# EAGLE design publish1 (EAGLE 6.5.0)
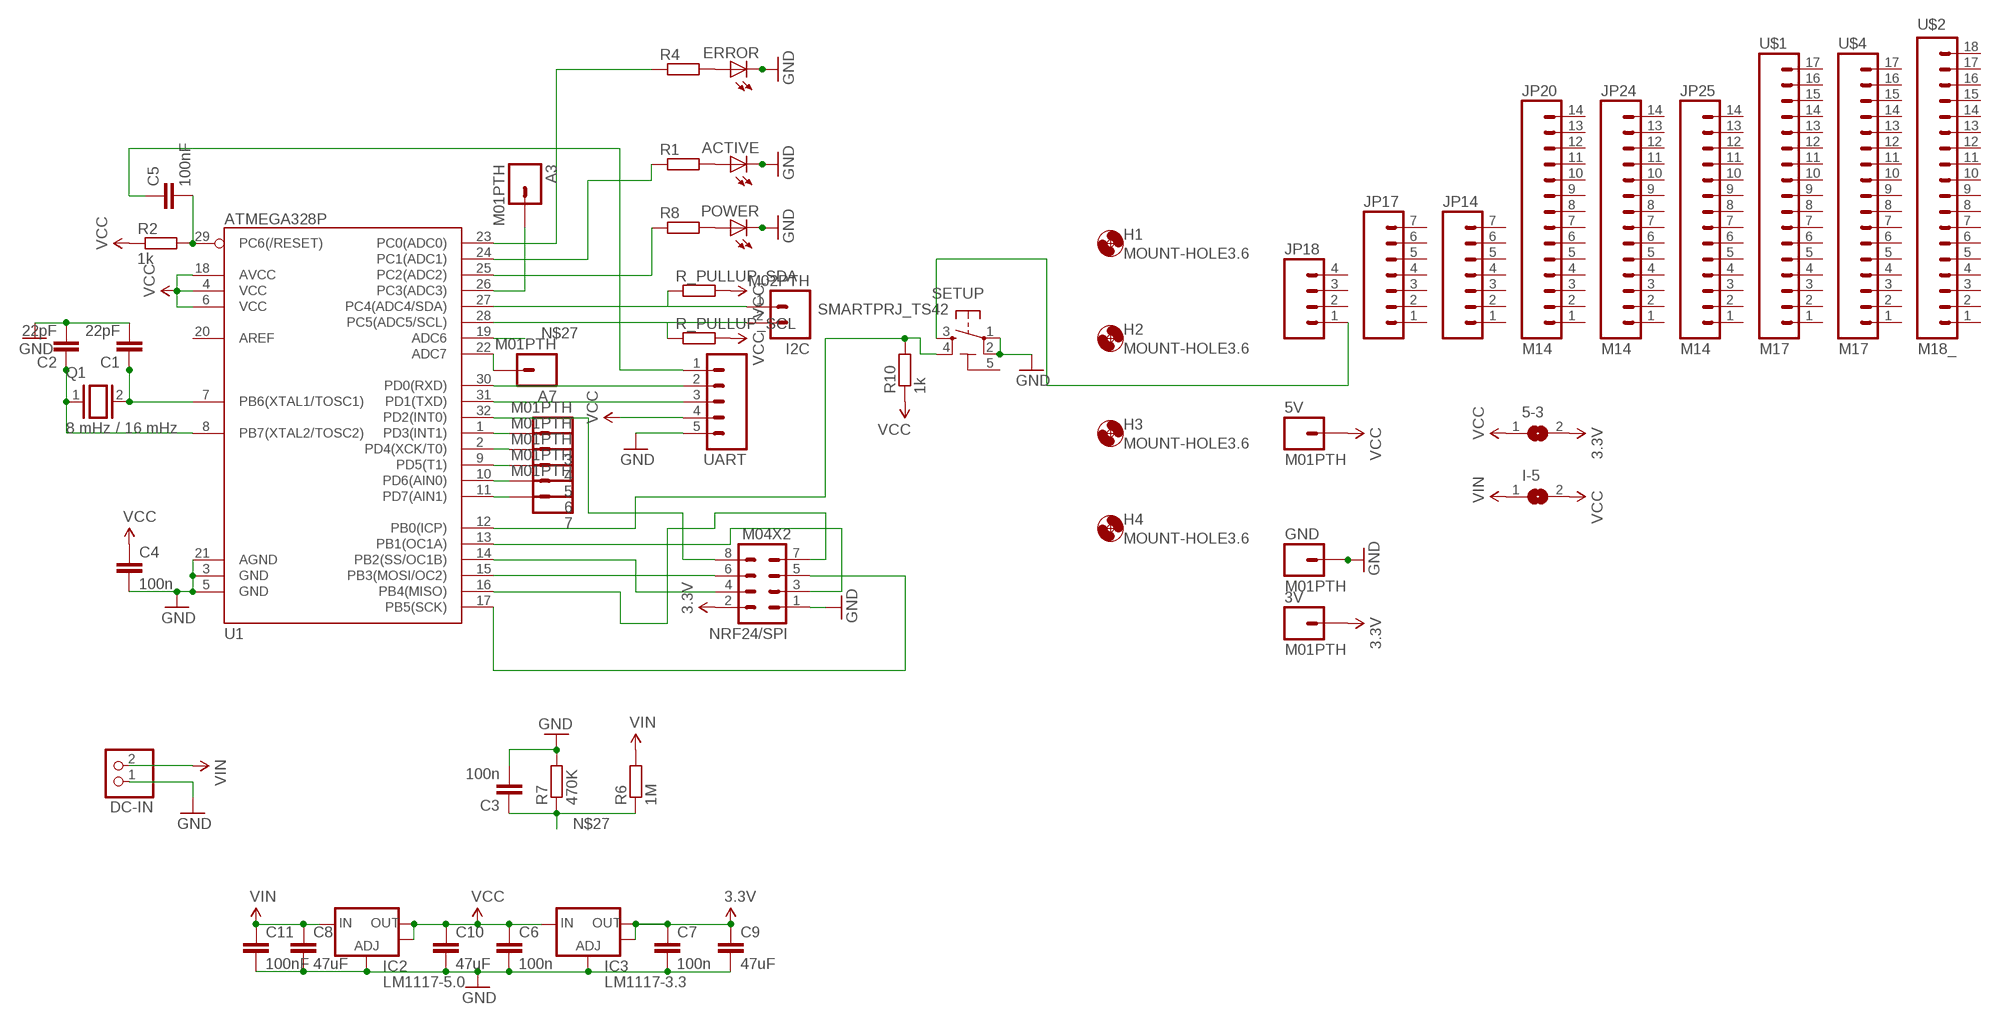
[diagram p0: schematic, sheet 1]

## Parts
3  M01PTH  [1X01]
3V  M01PTH  [1X01]
4  M01PTH  [1X01]
5  M01PTH  [1X01]
5-3  JUMPER_SJ  [JUMPER_SJ]
5V  M01PTH  [1X01]
6  M01PTH  [1X01]
7  M01PTH  [1X01]
A3  M01PTH  [1X01]
A7  M01PTH  [1X01]
ACTIVE  LEDCHIP-LED0805  [CHIP-LED0805]
C1  22pF  C-EUC0805K  [C0805K]
C2  22pF  C-EUC0805K  [C0805K]
C3  100n  C-EUC0805K  [C0805K]
C4  100n  C-EUC0805K  [C0805K]
C5  100nF  C-EUC0805K  [C0805K]
C6  100n  C-EUC0805K  [C0805K]
C7  100n  C-EUC0805K  [C0805K]
C8  47uF  22UF-16V-20%-(1210)  [1210]
C9  47uF  22UF-16V-20%-(1210)  [1210]
C10  47uF  22UF-16V-20%-(1210)  [1210]
C11  100nF  C-EUC0805K  [C0805K]
DC-IN  PINHD-1X2  [1X02]
ERROR  LEDCHIP-LED0805  [CHIP-LED0805]
GND  M01PTH  [1X01]
H1  MOUNT-HOLE3.6  [3,6]
H2  MOUNT-HOLE3.6  [3,6]
H3  MOUNT-HOLE3.6  [3,6]
H4  MOUNT-HOLE3.6  [3,6]
I2C  M02PTH  [1X02]
I-5  JUMPER_SJ  [JUMPER_SJ]
IC2  LM1117-5.0  V_REG_LM1117SOT223  [SOT223]
IC3  LM1117-3.3  V_REG_LM1117SOT223  [SOT223]
JP14  M07  [1X07]
JP17  M07  [1X07]
JP18  M04PTH  [1X04]
JP20  M14  [1X14]
JP24  M14  [1X14]
JP25  M14  [1X14]
NRF24/SPI  M04X2  [2X4]
POWER  LEDCHIP-LED0805  [CHIP-LED0805]
Q1  8 mHz / 16 mHz  XTAL/S  [QS]
R1  SMARTPRJ_R-EU_M0805  [SMARTPRJ_M0805]
R2  1k  SMARTPRJ_R-EU_M0805  [SMARTPRJ_M0805]
R4  SMARTPRJ_R-EU_M0805  [SMARTPRJ_M0805]
R6  1M  SMARTPRJ_R-EU_M0805  [SMARTPRJ_M0805]
R7  470K  SMARTPRJ_R-EU_M0805  [SMARTPRJ_M0805]
R8  SMARTPRJ_R-EU_M0805  [SMARTPRJ_M0805]
R10  1k  SMARTPRJ_R-EU_M0805  [SMARTPRJ_M0805]
R_PULLUP_SCL  SMARTPRJ_R-EU_M0805  [SMARTPRJ_M0805]
R_PULLUP_SDA  SMARTPRJ_R-EU_M0805  [SMARTPRJ_M0805]
SETUP  SMARTPRJ_TS42  [SMARTPRJ_TS42]
U1  ATMEGA328P  ATMEGA328_SMT  [TQFP32-08]
U$1  M17  [1X17]
U$2  M18_  [1X18]
U$4  M17  [1X17]
UART  M05PTH  [1X05]

## Nets
3.3V: 3V.1 5-3.2 C7.1 C9.1 IC3.2(OUT) IC3.4(OUT) NRF24/SPI.2
GND: ACTIVE.C C1.2 C2.2 C3.2 C4.2 C6.2 C7.2 C8.2 C9.2 C10.2 C11.2 DC-IN.1 ERROR.C GND.1 IC2.1(ADJ) IC3.1(ADJ) NRF24/SPI.1 POWER.C R7.2 SETUP.1 SETUP.2 U1.3(GND) U1.5(GND) U1.21(AGND) UART.5
N$1: C1.1 Q1.2 U1.7(PB6(XTAL1/TOSC1))
N$2: C2.1 Q1.1 U1.8(PB7(XTAL2/TOSC2))
N$3: NRF24/SPI.3 U1.13(PB1(OC1A))
N$4: NRF24/SPI.4 U1.14(PB2(SS/OC1B))
N$5: NRF24/SPI.5 U1.17(PB5(SCK))
N$6: NRF24/SPI.7 U1.16(PB4(MISO))
N$7: C5.1 UART.1
N$8: U1.30(PD0(RXD)) UART.2
N$9: U1.31(PD1(TXD)) UART.3
N$10: NRF24/SPI.6 U1.15(PB3(MOSI/OC2))
N$11: C5.2 R2.2 U1.29(PC6(/RESET))
N$12: NRF24/SPI.8 U1.32(PD2(INT0))
N$13: ACTIVE.A R1.2
N$14: ERROR.A R4.2
N$16: JP18.1 SETUP.3
N$20: R4.1 U1.23(PC0(ADC0))
N$21: R1.1 U1.24(PC1(ADC1))
N$27: C3.1 R6.1 R7.1 U1.19(ADC6)
N$41: POWER.A R8.2
N$42: R8.1 U1.25(PC2(ADC2))
N$44: A3.1 U1.26(PC3(ADC3))
N$45: 3.1 U1.1(PD3(INT1))
N$46: 4.1 U1.2(PD4(XCK/T0))
N$47: 5.1 U1.9(PD5(T1))
N$48: 6.1 U1.10(PD6(AIN0))
N$49: 7.1 U1.11(PD7(AIN1))
N$50: A7.1 U1.22(ADC7)
N$51: R10.2 SETUP.4 U1.12(PB0(ICP))
SCL: I2C.2 R_PULLUP_SCL.1 U1.28(PC5(ADC5/SCL))
SDA: I2C.1 R_PULLUP_SDA.1 U1.27(PC4(ADC4/SDA))
VCC: 5-3.1 5V.1 C4.1 C6.1 C10.1 I-5.2 IC2.2(OUT) IC2.4(OUT) IC3.3(IN) R2.1 R10.1 R_PULLUP_SCL.2 R_PULLUP_SDA.2 U1.4(VCC) U1.6(VCC) U1.18(AVCC) UART.4
VIN: C8.1 C11.1 DC-IN.2 I-5.1 IC2.3(IN) R6.2
Unconnected: JP14.1 JP14.2 JP14.3 JP14.4 JP14.5 JP14.6 JP14.7 JP17.1 JP17.2 JP17.3 JP17.4 JP17.5 JP17.6 JP17.7 JP18.2 JP18.3 JP18.4 JP20.1 JP20.2 JP20.3 JP20.4 JP20.5 JP20.6 JP20.7 JP20.8 JP20.9 JP20.10 JP20.11 JP20.12 JP20.13 JP20.14 JP24.1 JP24.2 JP24.3 JP24.4 JP24.5 JP24.6 JP24.7 JP24.8 JP24.9 JP24.10 JP24.11 JP24.12 JP24.13 JP24.14 JP25.1 JP25.2 JP25.3 JP25.4 JP25.5 JP25.6 JP25.7 JP25.8 JP25.9 JP25.10 JP25.11 JP25.12 JP25.13 JP25.14 U1.20(AREF) U$1.1 U$1.2 U$1.3 U$1.4 U$1.5 U$1.6 U$1.7 U$1.8 U$1.9 U$1.10 U$1.11 U$1.12 U$1.13 U$1.14 U$1.15 U$1.16 U$1.17 U$2.1 U$2.2 U$2.3 U$2.4 U$2.5 U$2.6 U$2.7 U$2.8 U$2.9 U$2.10 U$2.11 U$2.12 U$2.13 U$2.14 U$2.15 U$2.16 U$2.17 U$2.18 U$4.1 U$4.2 U$4.3 U$4.4 U$4.5 U$4.6 U$4.7 U$4.8 U$4.9 U$4.10 U$4.11 U$4.12 U$4.13 U$4.14 U$4.15 U$4.16 U$4.17

## Power pins joined to a net without a drawn wire
5-GND: SETUP.5(5-GND)

## Library data of the parts
3 3V 4 5 5V 6 7 A3 A7 GND = SparkFun-Connectors:M01: Header 1 Standard 1-pin 0.1" header. Use with straight break away headers (SKU : PRT-00116), right angle break away headers (PRT-00553), swiss pins (PRT-00743), machine pins (PRT-00117), and female headers (PRT-00115).
5-3 I-5 = arduino_Uno_Rev3-02-TH:JUMPER_SJ: SMD solder JUMPER
ACTIVE ERROR POWER = led:LED: LED OSRAM: - CHIPLED LG R971, LG N971, LY N971, LG Q971, LY Q971, LO R971, LY R971 LH N974, LH R974 LS Q976, LO Q976, LY Q976 LO Q996 - Hyper CHIPLED LW Q18S LB Q993, LB Q99A, LB R99A - SideLED LS A670, LO A670, LY A670, LG A670, LP A670 LB A673, LV A673, LT A673, LW A673 LH A674 LY A675 LS A676, LA A676, LO A676, LY A676, LW A676 LS A679, LY A679, LG A679 - Hyper Micro SIDELED® LS Y876, LA Y876, LO Y876, LY Y876 LT Y87S - SmartLED LW L88C, LW L88S LB L89C, LB L89S, LG L890 LS L89K, LO L89K, LY L89K LS L896, LA L896, LO L896, LY L896 - TOPLED LS T670, LO T670, LY T670, LG T670, LP T670 LSG T670, LSP T670, LSY T670, LOP T670, LYG T670 LG T671, LOG T671, LSG T671 LB T673, LV T673, LT T673, LW T673 LH T674 LS T676, LA T676, LO T676, LY T676, LB T676, LH T676, LSB T676, LW T676 LB T67C, LV T67C, LT T67C, LS T67K, LO T67K, LY T67K, LW E67C LS E67B, LA E67B, LO E67B, LY E67B, LB E67C, LV E67C, LT E67C LW T67C LS T679, LY T679, LG T679 LS T770, LO T770, LY T770, LG T770, LP T770 LB T773, LV T773, LT T773, LW T773 LH T774 LS E675, LA E675, LY E675, LS T675 LS T776, LA T776, LO T776, LY T776, LB T776 LHGB T686 LT T68C, LB T68C - Hyper Mini TOPLED® LB M676 - Mini TOPLED Santana® LG M470 LS M47K, LO M47K, LY M47K Source: http://www.osram.convergy.de LUXEON: - LUMILED® LXK2-PW12-R00, LXK2-PW12-S00, LXK2-PW14-U00, LXK2-PW14-V00 LXK2-PM12-R00, LXK2-PM12-S00, LXK2-PM14-U00 LXK2-PE12-Q00, LXK2-PE12-R00, LXK2-PE12-S00, LXK2-PE14-T00, LXK2-PE14-U00 LXK2-PB12-K00, LXK2-PB12-L00, LXK2-PB12-M00, LXK2-PB14-N00, LXK2-PB14-P00, LXK2-PB14-Q00 LXK2-PR12-L00, LXK2-PR12-M00, LXK2-PR14-Q00, LXK2-PR14-R00 LXK2-PD12-Q00, LXK2-PD12-R00, LXK2-PD12-S00 LXK2-PH12-R00, LXK2-PH12-S00 LXK2-PL12-P00, LXK2-PL12-Q00, LXK2-PL12-R00 Source: www.luxeon.com KINGBRIGHT: KA-3528ASYC Source: www.kingbright.com
C1-C7 C11 = rcl:C-EU: CAPACITOR, European symbol
C8-C10 = SparkFun-Capacitors:22UF-16V-20%-(1210): CAP-10381; PROD_ID: CAP-10381; VALUE: 22uF
DC-IN = pinhead:PINHD-1X2: PIN HEADER
H1-H4 = holes:MOUNT-HOLE: MOUNTING HOLE with drill center marker
I2C = SparkFun-Connectors:M02: Standard 2-pin 0.1" header. Use with - straight break away headers ( PRT-00116) - right angle break away headers (PRT-00553) - swiss pins (PRT-00743) - machine pins (PRT-00117) - female headers (PRT-00115) Molex polarized connector foot print use with: PRT-08233 with associated crimp pins and housings. 2.54_SCREWTERM for use with PRT-10571. 3.5mm Screw Terminal footprints for PRT-08084 5mm Screw Terminal footprints for use with PRT-08433
IC2 IC3 = SparkFun-PowerIC:V_REG_LM1117: Voltage Regulator LM1117 Standard adjustable voltage regulator but in SMD form. Spark Fun Electronics SKU : COM-00595
JP14 JP17 = SparkFun-Connectors:M07: Header 7 Standard 7-pin 0.1" header. Use with straight break away headers (SKU : PRT-00116), right angle break away headers (PRT-00553), swiss pins (PRT-00743), machine pins (PRT-00117), and female headers (PRT-00115). NOTES ON THE VARIANTS LOCK and LOCK_LONGPADS... This footprint was designed to help hold the alignment of a through-hole component (i.e. 7-pin header) while soldering it into place. You may notice that each hole has been shifted either up or down by 0.005 of an inch from it's more standard position (which is usually a perfectly straight line). This slight alteration caused the pins (the squares in the middle) to touch the edges of the holes. Because they are alternating, it causes a "brace" to hold the header in place. 0.005 has proven to be the perfect amount of "off-center" position when using our standard breakaway headers. Although looks a little odd when you look at the bare footprint, once you have a header in there, the alteration is very hard to notice. Also, if you push a header all the way into place, it is covered up entirely on the bottom side. This idea of altering the position of holes to aid alignment will be further integrated into the Sparkfun Library for other footprints. It can help hold any component with 3 or more connection pins.
JP18 = SparkFun-Connectors:M04: Header 4 Standard 4-pin 0.1" header. Use with straight break away headers (SKU : PRT-00116), right angle break away headers (PRT-00553), swiss pins (PRT-00743), machine pins (PRT-00117), and female headers (PRT-00115). Molex polarized connector foot print use with SKU : PRT-08231 with associated crimp pins and housings. 1MM SMD Version SKU: PRT-10208
JP20 JP24 JP25 = SparkFun-Connectors:M14: Header 14 Standard 14-pin 0.1" header. Use with straight break away headers (SKU : PRT-00116), right angle break away headers (PRT-00553), swiss pins (PRT-00743), machine pins (PRT-00117), and female headers (PRT-00115).
NRF24/SPI = SparkFun-Connectors:M04X2: .1" header, two rows of four.
Q1 = special:XTAL/S: CRYSTAL
R1 R2 R4 R6-R8 R10 R_PULLUP_SCL R_PULLUP_SDA = arduino_Uno_Rev3-02-TH:SMARTPRJ_R-EU_: RESISTOR, European symbol
SETUP = arduino_Uno_Rev3-02-TH:SMARTPRJ_TS42: TS42 Dongnan Electronics Tact switch VDC 12V - 50mA
U1 = SparkFun-DigitalIC:ATMEGA328_SMT: 32-Pin Atmega328 part Commonly used on Arduino compatible boards Available in QFP and QFN packages TQFP is IC-09069 QFN is non-stock; PROD_ID: IC-09069
U$1 U$4 = SparkFun-Connectors:M17: 1x17 .1" header
U$2 = SparkFun-Connectors:M18: 1x18 .1" header
UART = SparkFun-Connectors:M05: Header 5 Standard 5-pin 0.1" header. Use with straight break away headers (SKU : PRT-00116), right angle break away headers (PRT-00553), swiss pins (PRT-00743), machine pins (PRT-00117), and female headers (PRT-00115). Molex polarized connector foot print use with SKU : PRT-08230 with associated crimp pins and housings.

## Net classes
0 default: clearance 0.205 mm

## Board
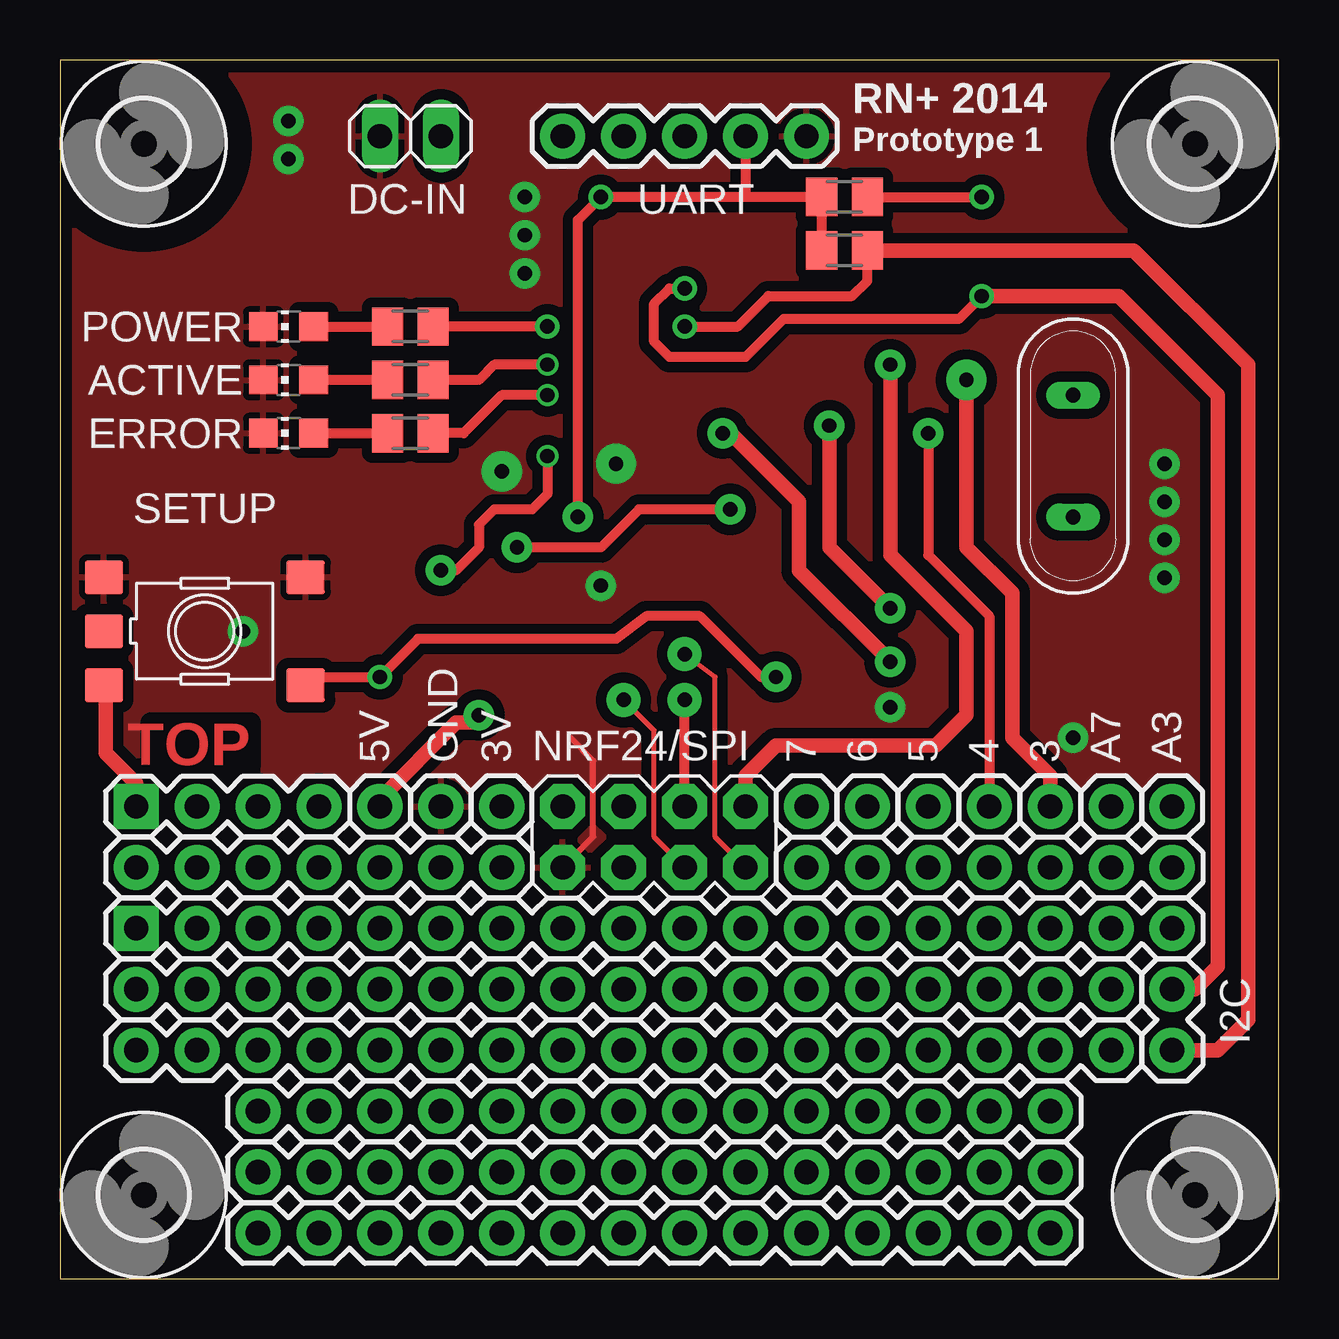
[diagram p1: board, top side]
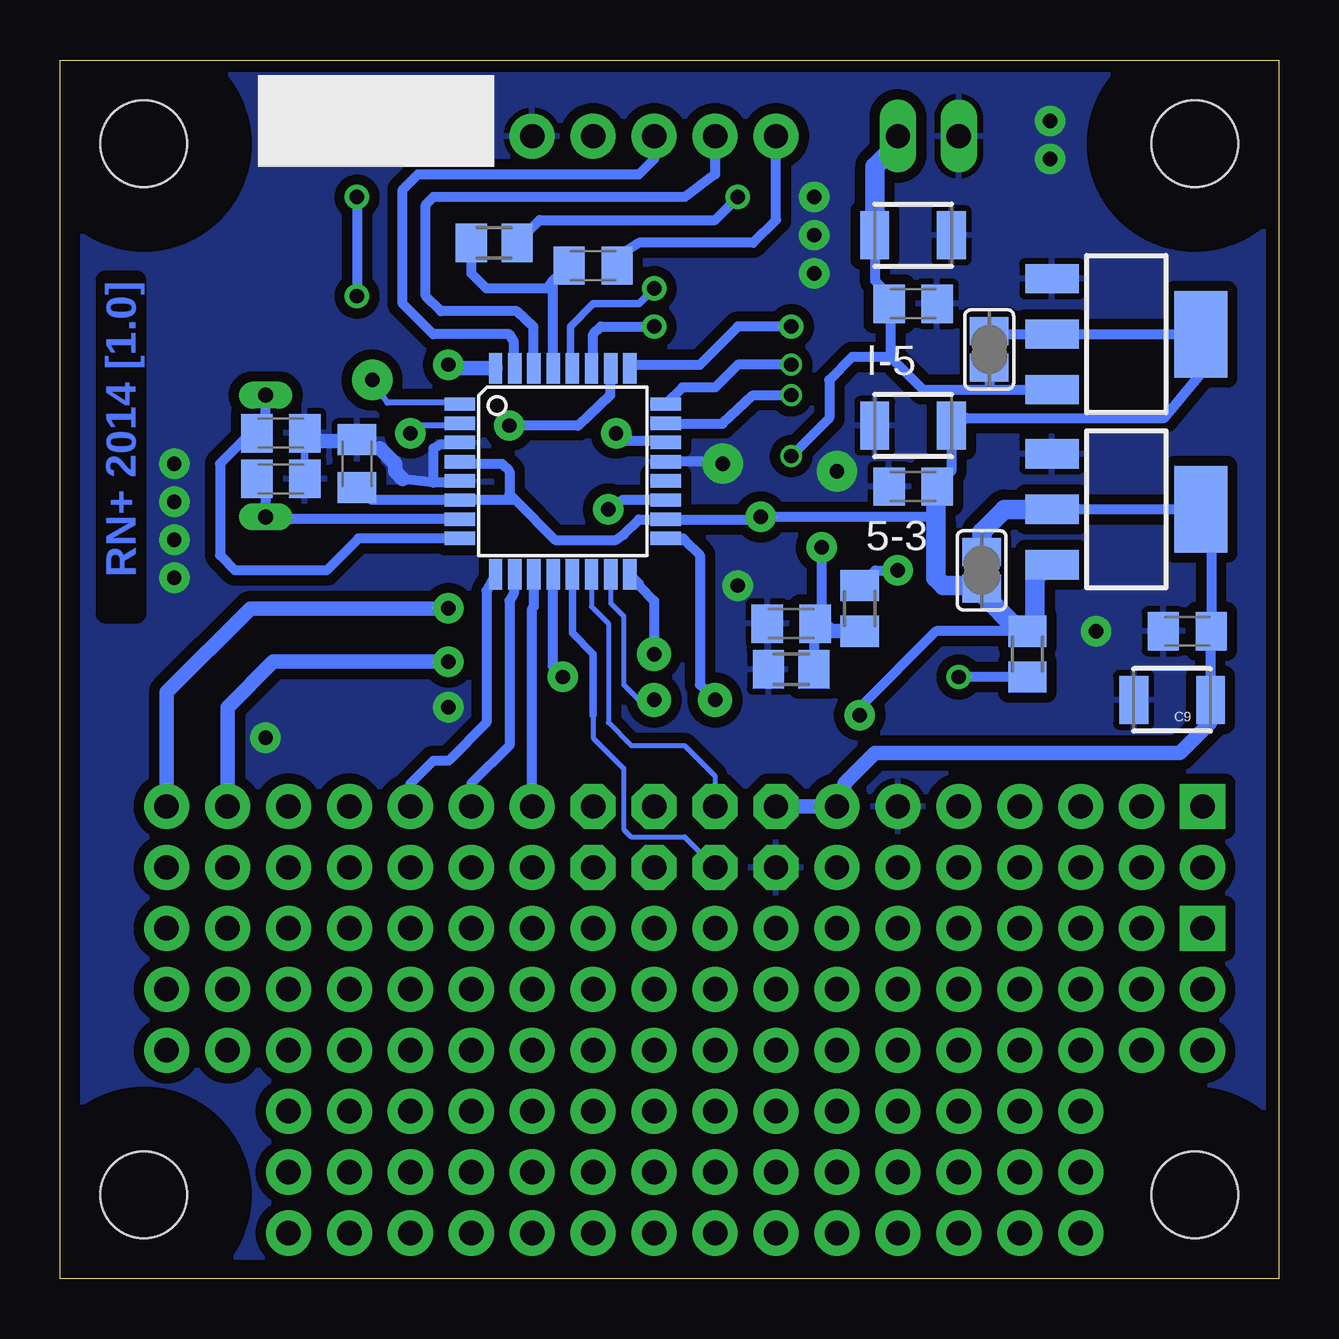
[diagram p2: board, bottom side, seen from below]

Size 50.8 x 50.8 mm. Coordinates in mm from the lower left corner, seen from the top.
Outline: 0,0 50.8,0 50.8,50.8 0,50.8 0,0
Copper layers (1*16): Top 0.035mm / dielectric 1.5mm / Bottom 0.035mm
Design rules "dirt_cheap_dirty_boards.v1": minimum track width 5mil, minimum drill 12mil, track to track 5mil, track to pad 5mil, pad to pad 5mil, via to via 5mil, smd to smd 0mil, copper to edge 10mil, drill to drill 10mil, minimum pad ring 10mil, minimum via ring 6mil, stop-mask expansion 2mil, vias tented up to drill 25mil, thermal gap 10mil

### Footprints (pad centres in the part's own frame; a part is rotated, then mirrored left to right if it is on the bottom)
1X01 = drill 1.016 pad 1.88: 1 0,0
JUMPER_SJ = smd 1.168 x 1.6: 1 -0.762,0; 2 0.762,0
CHIP-LED0805 = smd 1.2 x 1.2: A 0,-1.05; C 0,1.05
C0805K = smd 1.3 x 1.6: 1 -1,0; 2 1,0
1210 = smd 1.2 x 2: 1 -1.6,0; 2 1.6,0
1X02 = drill 1.016 long: 1 -1.27,0; 2 1.27,0
3,6 = hole 3.6: 0,0
1X02' = drill 1.016 pad 1.88: 1 0,0; 2 2.54,0
SOT223 = smd 1.219 x 2.235: 1 -2.311,-3.099; 2 0,-3.099; 3 2.311,-3.099 | smd 3.6 x 2.2: 4 0,3.099
1X07 = drill 1.016 pad 1.88: 1 0,0; 2 2.54,0; 3 5.08,0; 4 7.62,0; 5 10.16,0; 6 12.7,0; 7 15.24,0
1X04 = drill 1.016 pad 1.88 square: 1 0,0 | drill 1.016 pad 1.88: 2 2.54,0; 3 5.08,0; 4 7.62,0
1X14 = drill 1.016 pad 1.88: 1 0,0; 2 2.54,0; 3 5.08,0; 4 7.62,0; 5 10.16,0; 6 12.7,0; 7 15.24,0; 8 17.78,0; 9 20.32,0; 10 22.86,0; 11 25.4,0; 12 27.94,0; 13 30.48,0; 14 33.02,0
2X4 = drill 1.016 pad 1.88 octagon: 1 -3.81,-1.27; 2 -3.81,1.27; 3 -1.27,-1.27; 4 -1.27,1.27; 5 1.27,-1.27; 6 1.27,1.27; 7 3.81,-1.27; 8 3.81,1.27
QS = drill 0.61 long: 1 -2.54,0; 2 2.54,0
SMARTPRJ_M0805 = smd 1.3 x 1.6: 1 -0.95,0; 2 0.95,0
SMARTPRJ_TS42 = smd 1.6 x 1.4: 1 -4.2,2.25; 2 4.2,2.25; 3 -4.2,-2.25; 4 4.2,-2.25; 5 -4.2,0
TQFP32-08 = smd 1.27 x 0.559: 1 -4.293,2.8; 2 -4.293,2; 3 -4.293,1.2; 4 -4.293,0.4; 5 -4.293,-0.4; 6 -4.293,-1.2; 7 -4.293,-2; 8 -4.293,-2.8; 17 4.293,-2.8; 18 4.293,-2; 19 4.293,-1.2; 20 4.293,-0.4; 21 4.293,0.4; 22 4.293,1.2; 23 4.293,2; 24 4.293,2.8 | smd 0.559 x 1.27: 9 -2.8,-4.293; 10 -2,-4.293; 11 -1.2,-4.293; 12 -0.4,-4.293; 13 0.4,-4.293; 14 1.2,-4.293; 15 2,-4.293; 16 2.8,-4.293; 25 2.8,4.293; 26 2,4.293; 27 1.2,4.293; 28 0.4,4.293; 29 -0.4,4.293; 30 -1.2,4.293; 31 -2,4.293; 32 -2.8,4.293
1X17 = drill 1.016 pad 1.88: 1 0,0; 2 2.54,0; 3 5.08,0; 4 7.62,0; 5 10.16,0; 6 12.7,0; 7 15.24,0; 8 17.78,0; 9 20.32,0; 10 22.86,0; 11 25.4,0; 12 27.94,0; 13 30.48,0; 14 33.02,0; 15 35.56,0; 16 38.1,0; 17 40.64,0
1X18 = drill 1.016 pad 1.88 square: 1 0,0 | drill 1.016 pad 1.88: 2 2.54,0; 3 5.08,0; 4 7.62,0; 5 10.16,0; 6 12.7,0; 7 15.24,0; 8 17.78,0; 9 20.32,0; 10 22.86,0; 11 25.4,0; 12 27.94,0; 13 30.48,0; 14 33.02,0; 15 35.56,0; 16 38.1,0; 17 40.64,0; 18 43.18,0
1X05 = drill 1.016 pad 1.88: 1 0,0; 2 2.54,0; 3 5.08,0; 4 7.62,0; 5 10.16,0

### Placement (x,y rotation side)
3  41.27,19.68 0 top
3V  18.41,19.68 0 top
4  38.73,19.68 0 top
5  36.2,19.68 0 top
5-3  12.38,29.53 90 bottom
5V  13.34,19.68 0 top
6  33.66,19.68 0 top
7  31.11,19.68 0 top
A3  46.35,19.68 0 top
A7  43.81,19.68 0 top
ACTIVE  9.53,37.47 90 top
C1  41.59,33.34 0 bottom
C2  41.59,35.24 0 bottom
C3  20.32,27.3 180 bottom
C4  38.42,33.97 90 bottom
C5  28.57,42.23 180 bottom
C6  15.24,33.02 180 bottom
C7  3.81,26.99 180 bottom
C8  15.24,43.5 0 bottom
C9  4.45,24.13 180 bottom
C10  15.24,35.56 180 bottom
C11  15.24,40.64 0 bottom
DC-IN  14.61,47.62 0 top
ERROR  9.53,35.24 90 top
GND  15.88,19.68 0 top
H1  3.49,3.49 0 top
H2  3.49,47.31 0 top
H3  47.31,3.49 0 top
H4  47.31,47.31 0 top
I2C  M02PTH  [1X02']  46.35,9.53 90 top
I-5  12.06,38.73 90 bottom
IC2  6.35,39.37 270 bottom
IC3  6.35,32.07 270 bottom
JP14  31.11,17.14 0 top
JP17  3.17,17.14 0 top
JP18  3.17,19.68 0 top
JP20  8.26,6.99 0 top
JP24  8.26,4.45 0 top
JP25  8.26,1.91 0 top
NRF24/SPI  24.77,18.41 0 top
POWER  9.53,39.69 90 top
Q1  42.23,34.29 270 top
R1  14.61,37.47 180 top
R2  32.7,43.18 180 bottom
R4  14.61,35.24 180 top
R6  17.46,27.94 90 bottom
R7  20.32,25.4 180 bottom
R8  14.61,39.69 180 top
R10  10.48,26.04 270 bottom
R_PULLUP_SCL  32.7,45.09 180 top
R_PULLUP_SDA  32.7,42.86 180 top
SETUP  6.03,26.99 0 top
U1  29.84,33.66 0 bottom
U$1  3.17,9.53 0 top
U$2  3.17,14.61 0 top
U$4  3.17,12.06 0 top
UART  20.95,47.62 0 top

### Tracks (layer width: path | path; a pad name or v marks a point on that pad's centre or on a via)
3.3V
  Bottom 0.406: IC3.2 IC3.4 2.81,31.63 C7.1 2.85,26.95 C9.1
  Bottom 0.61: NRF24/SPI.2 3V.1 18.1,20 18.1,20.64 16.83,21.91 4.13,21.91 2.85,23.19 C9.1
  Bottom 0.813: 5-3.2 12.38,31.11 11.43,32.07 IC3.2
GND  (via drill 0.6 pad 1.27, 0.6 pad 1.68)
  Top 0.254: NRF24/SPI.1 22.23,18.41 22.23,21.59 21.27,22.54
  Bottom 0.305: C1.2 C2.2
  Bottom 0.406: v23.18,33.97 23.26,34.05 U1.21 | 37.48,34.62 C4.2 38.42,34.92 | U1.5 34.22,33.18 35.24,33.18 | 35.24,33.18 36.51,33.34 | U1.3 34.21,34.78 34.92,34.78 35.24,34.61 35.24,33.18
  Bottom 0.61: 36.51,33.34 36.83,33.66 36.83,33.97 37.48,34.62 | 39.98,34.94 39.96,34.92 38.42,34.92
  other vias: 18.41,33.66 19.37,43.5 34.61,23.81 9.53,48.26 9.53,46.67 7.62,26.99 19.37,41.91 22.54,28.89 19.37,45.09 46.04,33.97 42.23,22.54 46.04,32.38 46.04,30.8 46.04,29.21
  pour Top (isolate 0.432): 0.64,50.16 49.85,50.16 49.85,-0.64 0.64,0.64
  pour Bottom (isolate 0.432): 0.64,50.16 49.85,50.16 49.85,0.95 0.64,0.64
N$1
  Bottom 0.406: C1.1 42.21,33.02 Q1.2 41.18,31.66 U1.7
N$2
  Bottom 0.406: Q1.1 42.23,35.88 C2.1 43.18,34.92 44.13,33.97 44.13,30.16 43.5,29.53 39.69,29.53 38.36,30.86 U1.8
N$3
  Bottom 0.203: 28.57,23.5 28.57,22.54 27.3,21.27 27.3,18.73 26.99,18.41 24.77,18.41 NRF24/SPI.3
  Bottom 0.305: 28.57,23.5 28.57,26.04 29.45,26.91 U1.13
N$4
  Bottom 0.203: U1.14 28.64,28.01 27.94,27.3 27.94,23.18 26.99,22.23 24.77,22.23 23.5,20.95 NRF24/SPI.4
N$5  (via drill 0.6 pad 1.42)
  Top 0.203: NRF24/SPI.5 24.77,18.41 24.77,22.86 v23.5,24.13
  Bottom 0.203: 25.5,30.8 U1.17
  Bottom 0.406: U1.17 24.82,30.86 | 25.5,30.8 24.77,30.8 24.13,30.16 24.13,24.77 v23.5,24.13
N$6  (via drill 0.6 pad 1.42)
  Top 0.203: v26.04,26.04 27.3,25.08 27.3,18.41 NRF24/SPI.7
  Bottom 0.203: 26.99,29.3 U1.16
  Bottom 0.406: 26.99,29.3 26.67,28.99 26.67,28.89 26.04,28.26 v26.04,26.04
N$7
  Bottom 0.406: UART.1 20.95,44.13 21.91,43.18 26.67,43.18 27.57,42.59 C5.1
N$8
  Bottom 0.406: UART.2 23.5,46.04 24.77,45.09 35.24,45.09 35.56,44.77 35.56,40.96 34.92,40.32 31.75,40.32 31.06,39.69 31.06,38.02 U1.30
N$9
  Bottom 0.406: UART.3 26.04,46.67 26.67,46.04 35.88,46.04 36.51,45.4 36.51,40.64 35.24,39.37 32.07,39.37 31.88,39.05 31.88,37.73 U1.31
N$10  (via drill 0.6 pad 1.42)
  Top 0.406: NRF24/SPI.6 v26.04,24.13
  Bottom 0.203: U1.15 27.84,28.16 27.3,27.62 27.3,24.77 26.67,24.13 v26.04,24.13
N$11
  Bottom 0.406: R2.2 33.65,41.91 33.66,41.91 33.02,41.27 30.53,41.27 30.25,41.62 | C5.2 30.25,41.62 | U1.29 30.25,38.01 30.25,41.62
N$12  (via drill 0.6 pad 1.27)
  Top 0.61: v34.61,38.1 34.61,30.16 37.78,26.99 37.78,23.5 36.51,22.23 29.84,22.23 28.57,20.95 NRF24/SPI.8
  Bottom 0.61: v34.61,38.1 34.45,37.95 U1.32
N$13
  Top 0.406: R1.2 ACTIVE.A
N$14
  Top 0.406: ERROR.A R4.2
N$16
  Top 0.61: SETUP.3 1.91,24.66 1.91,21.91 3.17,20.64 JP18.1
N$20  (via drill 0.6 pad 0.25)
  Top 0.406: v20.32,36.83 18.41,36.83 16.83,35.24 R4.1
  Bottom 0.406: U1.23 25.46,35.64 23.18,35.64 21.91,36.83 v20.32,36.83
N$21  (via drill 0.6)
  Top 0.406: v20.32,38.1 18.1,38.1 17.46,37.47 R1.1
  Bottom 0.406: v20.32,38.1 22.54,38.1 23.5,37.15 24.86,37.15 U1.24
N$27  (via drill 0.6 pad 1.27)
  Top 0.406: v27.94,32.07 24.13,32.07 22.54,30.48 v19.05,30.48
  Bottom 0.406: U1.19 27.38,32.45 v27.94,32.07 | R7.1 19.37,27.89 C3.1 19.05,27.35 v19.05,30.48
  Bottom 0.61: 19.05,27.35 18.69,26.99 R6.1
N$41
  Top 0.406: POWER.A R8.2
N$42  (via drill 0.6 pad 1.02)
  Top 0.406: v20.32,39.69 R8.1
  Bottom 0.305: 27.05,38.1 U1.25
  Bottom 0.406: 27.05,38.1 24.13,38.1 22.54,39.69 v20.32,39.69
N$44  (via drill 0.6 pad 1.27)
  Top 0.61: v34.61,27.94 32.07,30.48 v32.07,35.56
  Bottom 0.406: U1.26 27.86,37.85 27.86,36.83 29.21,35.56 v32.07,35.56
  Bottom 0.61: A3.1 46.35,24.45 42.86,27.94 v34.61,27.94
N$45  (via drill 0.6 pad 1.68)
  Top 0.61: v37.78,37.47 37.78,30.48 39.69,28.57 39.69,22.54 41.27,20.95 3.1
  Bottom 0.254: U1.1 34.2,36.51 37.15,36.51 v37.78,37.47
N$46  (via drill 0.6 pad 1.27)
  Top 0.406: v36.2,35.24 36.2,30.16 38.73,27.62 4.1
  Bottom 0.254: U1.2 34.23,35.56 36.2,35.56 v36.2,35.24
N$47
  Bottom 0.406: U1.9 33.02,28.67 33.02,23.18 34.61,21.59 35.24,21.59 36.2,20.64 5.1
N$48
  Bottom 0.406: U1.10 31.88,29.27 31.88,28.57 32.07,28.26 32.07,22.23 33.66,20.64 6.1
N$49
  Bottom 0.406: 31.04,29.29 U1.11 31.05,28.01 31.11,27.94 7.1
N$50  (via drill 0.6 pad 1.27)
  Top 0.61: v34.61,25.72 30.8,29.53 30.8,32.38 27.94,35.24 v27.62,35.24
  Bottom 0.406: U1.22 25.62,34.92 27.3,34.92 v27.62,35.24
  Bottom 0.61: A7.1 43.81,23.81 41.91,25.72 v34.61,25.72
N$51  (via drill 0.6 pad 1.02, 0.6 pad 1.27)
  Top 0.406: v29.84,25.08 29.21,25.08 26.67,27.62 24.45,27.62 23.18,26.67 14.92,26.67 v13.34,25.08 10.58,25.08 SETUP.4
  Bottom 0.203: U1.12 30.25,27.22
  Bottom 0.406: R10.2 11.1,25.08 v13.34,25.08 | v29.84,25.08 30.25,25.48 U1.12
SCL  (via drill 0.6 pad 1.02)
  Top 0.406: R_PULLUP_SCL.1 v38.42,45.09 | v26.04,41.27 25.4,41.27 24.77,40.64 24.77,39.05 25.4,38.42 28.57,38.42 30.16,40.01 37.47,40.01 v38.42,40.96
  Top 0.61: v38.42,40.96 44.13,40.96 48.26,36.83 48.26,13.02 47.31,12.06 I2C.2
  Bottom 0.305: 29.53,38.03 29.53,39.69 28.57,40.64 26.67,40.64 v26.04,41.27
  Bottom 0.406: U1.28 29.53,38.03 | v38.42,45.09 v38.42,40.96
SDA  (via drill 0.6 pad 1.02)
  Top 0.406: R_PULLUP_SDA.1 33.65,41.59 33.02,40.96 29.53,40.96 28.26,39.69 v26.04,39.69
  Top 0.61: I2C.1 48.26,9.53 49.53,10.79 49.53,38.1 44.77,42.86 R_PULLUP_SDA.1
  Bottom 0.406: U1.27 28.57,38.02 28.57,39.37 28.26,39.69 v26.04,39.69
VCC  (via drill 0.6 pad 1.02, 0.6 pad 1.27)
  Top 0.254: 5V.1 13.34,20.32
  Top 0.406: v21.59,31.75 21.59,44.13 v22.54,45.09 28.57,45.09 | UART.4 28.57,45.09 | 28.57,45.09 R_PULLUP_SCL.2 R_PULLUP_SDA.2
  Top 0.61: v17.46,23.5 17.14,23.18 16.51,23.18 13.34,20 5V.1
  Bottom 0.406: C4.1 37.8,32.46 33.5,32.46 U1.6 31.82,32.45 | R2.1 30.8,44.13 23.5,44.13 v22.54,45.09 | I-5.2 11.97,39.37 IC2.2 IC2.4 3.25,37.71 4.76,35.88 13.01,35.88 C10.1 13.65,35.55 13.65,33.66 14.24,33.07 C6.1 | U1.4 34.05,33.97 32.38,33.97 32.07,33.66 32.07,32.7 31.82,32.45 | 31.82,32.45 30.16,30.8 27.62,30.8 27.3,31.01 26.67,31.65 25.46,31.65 | R10.1 14.29,26.99 17.46,23.81 v17.46,23.5 | 14.29,31.43 14.61,31.75 v21.59,31.75 21.69,31.65 25.46,31.65 | U1.18 25.46,31.65
  Bottom 0.813: IC3.3 9.61,29.76 10.16,29.21 10.16,27.3 R10.1 10.79,26.98 12.38,28.57 5-3.1 12.51,28.89 13.97,28.89 14.29,29.21 14.29,31.43 14.29,32.97 C6.1
VIN  (via drill 0.6 pad 0.61, 0.6 pad 1.27)
  Top 0.406: v20.32,34.29 20.32,32.7 19.68,32.07 18.1,32.07 17.46,31.43 17.46,30.48 16.51,29.53 v15.88,29.53
  Bottom 0.406: C8.1 16.83,43.48 16.83,41.59 16.24,41.01 C11.1 16.19,40.59 16.19,38.42 | 12.06,37.06 14.83,37.06 16.19,38.42 | 12.06,37.06 IC2.3 | I-5.1 12.06,37.06 | 16.19,38.42 17.78,38.42 18.73,37.47 18.73,35.88 v20.32,34.29 | R6.2 16.82,29.53 v15.88,29.53
  Bottom 0.813: C8.1 16.83,43.51 16.83,46.35 15.88,47.31 DC-IN.2

### Text on the board
Top: TOP
Bottom: RN+ 2014 [1.0]
tNames: RN+ 2014 | Prototype 1
_bplace: 4